# EAGLE design ep2c5(128K+SD) (EAGLE 7.2.0)
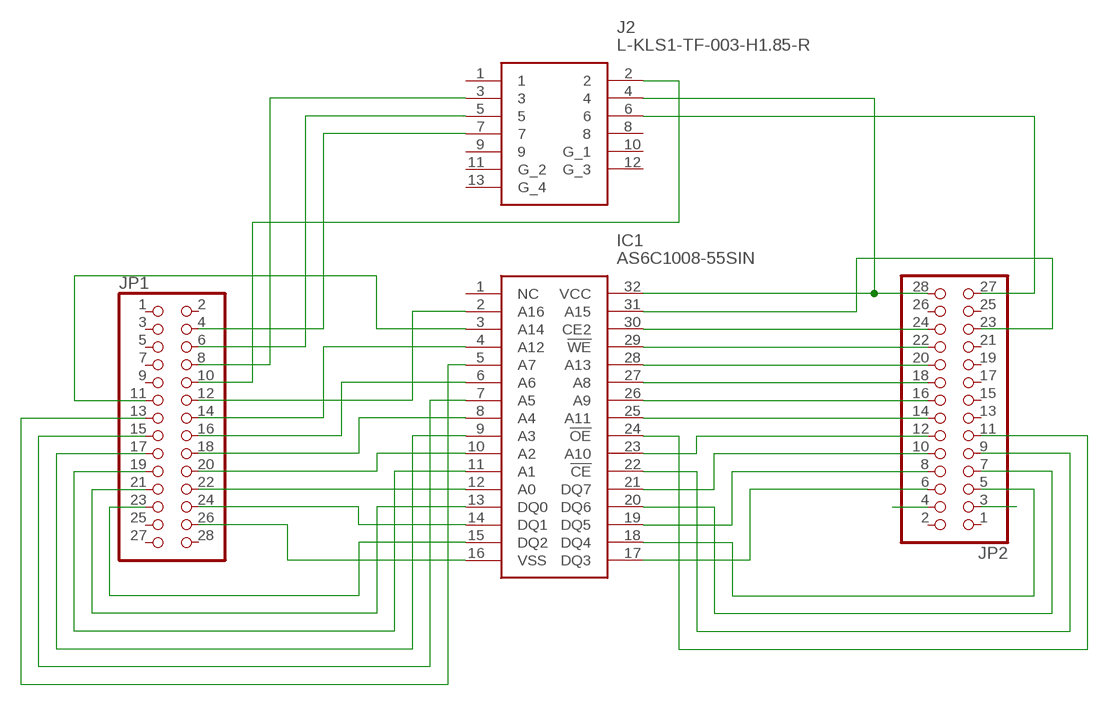
[diagram p0: schematic, sheet 1]

## Parts
IC1  AS6C1008-55SIN  [SOIC127P1407X299-32N]
J2  L-KLS1-TF-003-H1.85-R  [L-KLS1-TF-003-H1.85-R]
JP1  PINHD-2X14  [2X14]
JP2  PINHD-2X14  [2X14]

## Nets
N$1: J2.6 JP2.27
N$2: IC1.15(DQ2) JP1.23
N$3: J2.2 JP1.10
N$4: IC1.14(DQ1) JP1.24
N$5: IC1.12(A0) JP1.22
N$6: IC1.10(A2) JP1.20
N$7: IC1.8(A4) JP1.18
N$8: IC1.6(A6) JP1.16
N$9: J2.3 JP1.8
N$10: J2.5 JP1.6
N$11: J2.7 JP1.4
N$12: IC1.16(VSS) JP1.26
N$15: IC1.31(A15) JP2.23
N$16: IC1.4(A12) JP1.14
N$17: IC1.2(A16) JP1.12
N$18: IC1.13(DQ0) JP1.21
N$19: IC1.11(A1) JP1.19
N$21: IC1.9(A3) JP1.17
N$22: IC1.7(A5) JP1.15
N$23: IC1.5(A7) JP1.13
N$24: IC1.3(A14) JP1.11
N$25: IC1.17(DQ3) JP2.6
N$26: IC1.19(DQ5) JP2.8
N$27: IC1.21(DQ7) JP2.10
N$28: IC1.23(A10) JP2.12
N$29: IC1.18(DQ4) JP2.5
N$30: IC1.20(DQ6) JP2.7
N$31: IC1.22(!CE) JP2.9
N$32: IC1.24(!OE) JP2.11
N$33: IC1.25(A11) JP2.14
N$34: IC1.26(A9) JP2.16
N$37: IC1.27(A8) JP2.18
N$43: IC1.32(VCC) J2.4 JP2.28
N$44: IC1.28(A13) JP2.20
N$45: IC1.29(!WE) JP2.22
N$46: IC1.30(CE2) JP2.24
N$57: JP2.4
N$58: JP2.3
Unconnected: IC1.1(NC) J2.1 J2.8 J2.9 J2.10(G_1) J2.11(G_2) J2.12(G_3) J2.13(G_4) JP1.1 JP1.2 JP1.3 JP1.5 JP1.7 JP1.9 JP1.25 JP1.27 JP1.28 JP2.1 JP2.2 JP2.13 JP2.15 JP2.17 JP2.19 JP2.21 JP2.25 JP2.26

## Library data of the parts
IC1 = AS6C1008-55SIN:AS6C1008-55SIN: Alliance Memory AS6C1008-55SIN SRAM Memory, 1Mbit, 2.7 5.5 V, 55ns 32-Pin SOP Source: Datasheet <https://componentsearchengine.com/Datasheets/2/AS6C1008-55SIN.pdf>; DESCRIPTION: Alliance Memory AS6C1008-55SIN SRAM Memory, 1Mbit, 2.7 5.5 V, 55ns 32-Pin SOP; HEIGHT: mm; MANUFACTURER_NAME: Alliance Memory; MANUFACTURER_PART_NUMBER: AS6C1008-55SIN; MOUSER_PART_NUMBER: 913-AS6C1008-55SIN; MOUSER_PRICE-STOCK: https://www.mouser.com/Search/Refine.aspx?Keyword=913-AS6C1008-55SIN; RS_PART_NUMBER: 0538170; RS_PRICE-STOCK: http://uk.rs-online.com/web/p/products/0538170
J2 = L-KLS1-TF-003-H1.85-R:L-KLS1-TF-003-H1.85-R: Micro SD Card Connector Source: Datasheet <https://img.ozdisan.com/ETicaret_Dosya/476392_7149645.pdf>; DESCRIPTION: Micro SD Card Connector; HEIGHT: mm; MANUFACTURER_NAME: KLS Electronic; MANUFACTURER_PART_NUMBER: L-KLS1-TF-003-H1.85-R
JP1 JP2 = pinhead:PINHD-2X14: PIN HEADER

## Net classes
0 default: width 0.35 mm

## Board
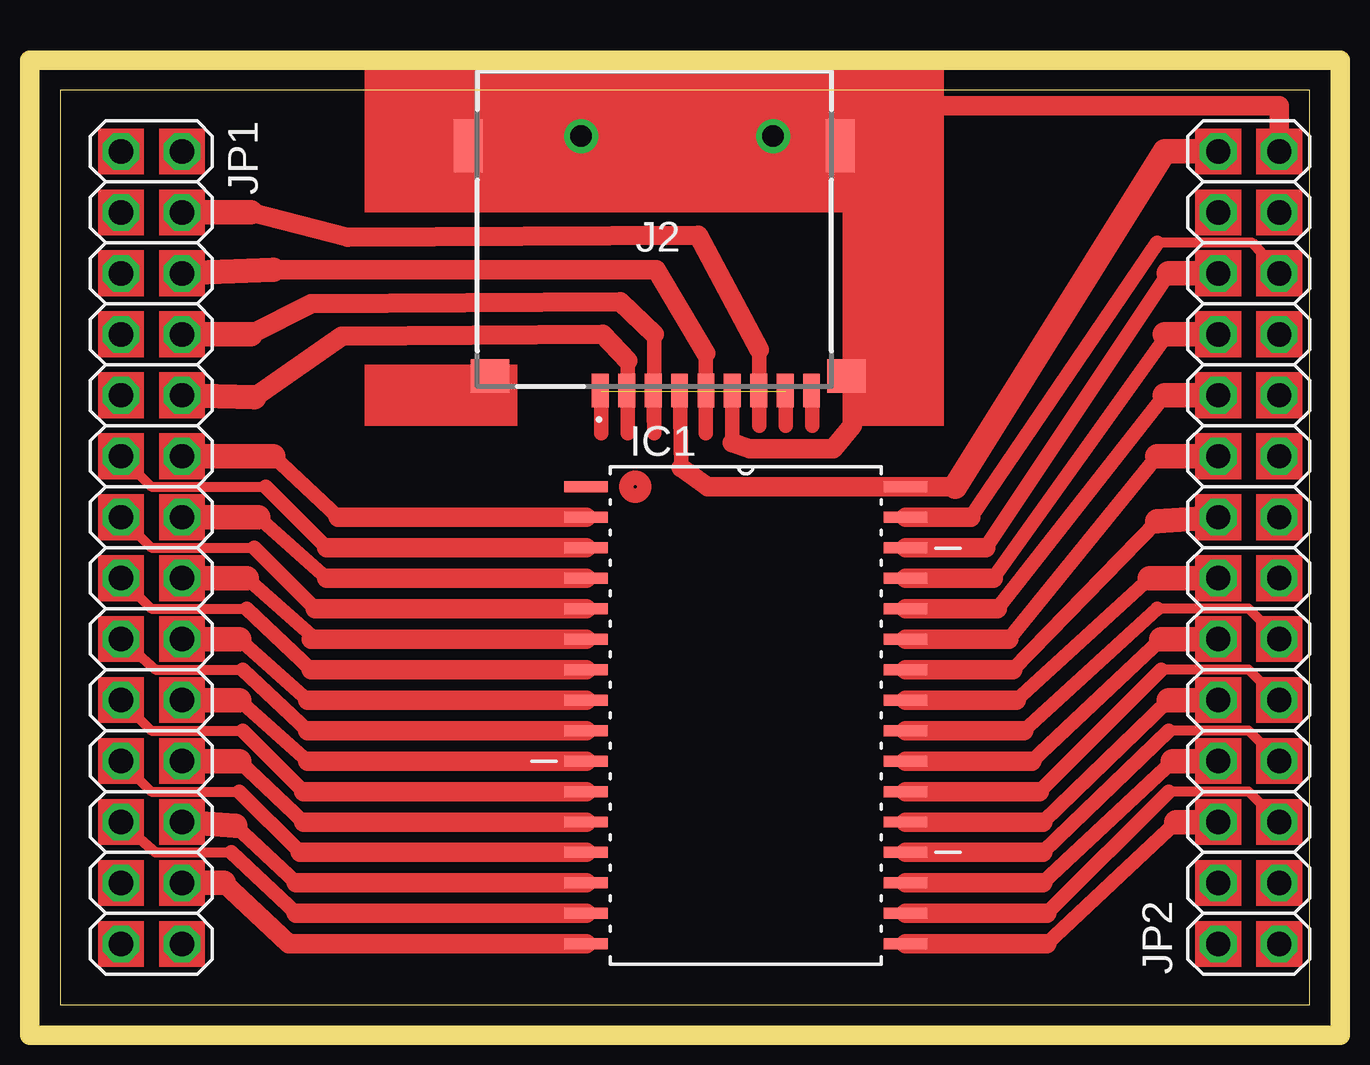
[diagram p1: board, top side]

Size 52.07 x 38.1 mm. Coordinates in mm from the lower left corner, seen from the top.
Outline: 0,0 52.07,0 52.07,38.1 0,38.1 0,0
Copper layers (1*16): Top 0.035mm / dielectric 1.5mm / Bottom 0.035mm
Design rules "default": minimum track width 10mil, minimum drill 24mil, track to track 8mil, track to pad 8mil, pad to pad 8mil, via to via 8mil, smd to smd 8mil, copper to edge 40mil, drill to drill 8mil, minimum pad ring 10mil, minimum via ring 8mil, stop-mask expansion 4mil, vias tented up to drill 0mil, thermal gap 10mil
Milling: 4 lines

### Footprints (pad centres in the part's own frame; a part is rotated, then mirrored left to right if it is on the bottom)
SOIC127P1407X299-32N = smd 1.803 x 0.457: 1 -6.655,9.525; 2 -6.655,8.255; 3 -6.655,6.985; 4 -6.655,5.715; 5 -6.655,4.445; 6 -6.655,3.175; 7 -6.655,1.905; 8 -6.655,0.635; 9 -6.655,-0.635; 10 -6.655,-1.905; 11 -6.655,-3.175; 12 -6.655,-4.445; 13 -6.655,-5.715; 14 -6.655,-6.985; 15 -6.655,-8.255; 16 -6.655,-9.525; 17 6.655,-9.525; 18 6.655,-8.255; 19 6.655,-6.985; 20 6.655,-5.715; 21 6.655,-4.445; 22 6.655,-3.175; 23 6.655,-1.905; 24 6.655,-0.635; 25 6.655,0.635; 26 6.655,1.905; 27 6.655,3.175; 28 6.655,4.445; 29 6.655,5.715; 30 6.655,6.985; 31 6.655,8.255; 32 6.655,9.525
L-KLS1-TF-003-H1.85-R = smd 0.7 x 1.4: 1 2.25,10.6; 2 1.15,10.6; 3 0.05,10.6; 4 -1.05,10.6; 5 -2.15,10.6; 6 -3.25,10.6; 7 -4.35,10.6; 8 -5.45,10.6; 9 -6.55,10.6 | smd 1.6 x 1.4: 10 -8,10; 13 6.85,10 | smd 1.2 x 2.2: 11 -7.75,0.4; 12 7.75,0.4 | drill 0.9 pad 1.4: 14 3.05,0; 15 -4.95,0
2X14 = drill 1.016 octagon: 1 -16.51,-1.27; 2 -16.51,1.27; 3 -13.97,-1.27; 4 -13.97,1.27; 5 -11.43,-1.27; 6 -11.43,1.27; 7 -8.89,-1.27; 8 -8.89,1.27; 9 -6.35,-1.27; 10 -6.35,1.27; 11 -3.81,-1.27; 12 -3.81,1.27; 13 -1.27,-1.27; 14 -1.27,1.27; 15 1.27,-1.27; 16 1.27,1.27; 17 3.81,-1.27; 18 3.81,1.27; 19 6.35,-1.27; 20 6.35,1.27; 21 8.89,-1.27; 22 8.89,1.27; 23 11.43,-1.27; 24 11.43,1.27; 25 13.97,-1.27; 26 13.97,1.27; 27 16.51,-1.27; 28 16.51,1.27

### Placement (x,y rotation side)
IC1  28.57,12.06 0 top
J2  24.77,36.2 180 top
JP1  3.81,19.05 270 top
JP2  49.53,19.05 90 top

### Tracks (layer width: path | path; a pad name or v marks a point on that pad's centre or on a via)
N$1
  Top 0.61: 28.02,23.42 J2.6
  Top 0.813: JP2.27 50.8,37.47 33.02,37.47 33.02,24.13 32.23,23.18 28.73,23.18 28.02,23.42
N$2
  Top 0.406: JP1.23 3.97,6.35 7.14,6.35
  Top 0.61: 7.14,6.35 9.84,3.81
  Top 0.813: 9.84,3.81 IC1.15
N$3
  Top 0.406: J2.2 23.65,23.81
  Top 0.61: 23.65,23.81 23.65,26.83
  Top 0.813: 23.65,26.83 22.62,27.94 11.75,27.86 8.1,25.32
  Top 1.016: 8.1,25.32 JP1.10
N$4
  Top 0.406: JP1.24 5.24,7.62
  Top 0.61: 7.3,7.46 9.84,5.08
  Top 0.813: 9.84,5.08 IC1.14
  Top 1.016: 5.24,7.62 7.3,7.46
N$5
  Top 0.61: 7.46,10.16 10.16,7.62
  Top 0.813: 10.16,7.62 IC1.12
  Top 1.016: JP1.22 7.46,10.16
N$6
  Top 0.61: 7.46,12.7 10.32,10.16
  Top 0.813: 10.32,10.16 IC1.10
  Top 1.016: JP1.20 7.46,12.7
N$7
  Top 0.61: 7.46,15.24 10.32,12.7
  Top 0.813: 10.32,12.7 IC1.8
  Top 1.016: JP1.18 7.46,15.24
N$8
  Top 0.406: 10.48,15.4 10.48,15.24
  Top 0.61: 7.78,17.78 10.48,15.4
  Top 0.813: 10.48,15.24 IC1.6
  Top 1.016: JP1.16 7.78,17.78
N$9
  Top 0.61: J2.3 24.77,23.81 24.77,27.94
  Top 0.813: 24.77,27.94 23.34,29.29 10.48,29.21 7.94,27.94
  Top 1.016: 7.94,27.94 JP1.8
N$10
  Top 0.406: J2.5 26.91,23.81
  Top 0.61: 26.91,23.81 26.91,27.15
  Top 0.813: 26.91,27.15 24.84,30.64 8.89,30.64
  Top 1.016: 8.89,30.64 JP1.6
N$11
  Top 0.406: J2.7 29.13,24.13
  Top 0.61: 29.13,24.13 29.13,27.3
  Top 0.813: 29.13,27.3 26.59,32.07 11.99,31.99 7.94,33.02
  Top 1.016: 7.94,33.02 JP1.4
N$12
  Top 0.813: 6.83,5.08 9.53,2.54 IC1.16
  Top 1.016: JP1.26 6.83,5.08
N$13  (1 unrouted)
  Top 0.61: 30.24,25.56 30.24,24.13 | 22.54,25.56 22.54,23.81
N$14
  Top 0.14: 31.27,25.72 31.35,25.72
  Top 0.61: 31.35,25.72 31.35,24.13
N$15
  Top 0.406: JP2.23 49.69,31.75 45.72,31.75
  Top 0.61: 45.72,31.75 37.94,20.32
  Top 0.813: 37.94,20.32 IC1.31
N$16
  Top 0.61: 8.26,20.32 11.11,17.78
  Top 0.813: 11.11,17.78 IC1.4
  Top 1.016: JP1.14 8.26,20.32
N$17
  Top 0.61: 8.89,22.86 11.59,20.32
  Top 0.813: 11.59,20.32 IC1.2
  Top 1.016: JP1.12 8.89,22.86
N$18
  Top 0.406: JP1.21 3.81,8.89 7.46,8.89
  Top 0.61: 7.46,8.89 10,6.35
  Top 0.813: 10,6.35 IC1.13
N$19
  Top 0.406: JP1.19 3.81,11.43 7.62,11.43
  Top 0.61: 7.62,11.43 10.16,8.89
  Top 0.813: 10.16,8.89 IC1.11
N$21
  Top 0.406: JP1.17 3.97,13.97 7.62,13.97
  Top 0.61: 7.62,13.97 10.32,11.43
  Top 0.813: 10.32,11.43 IC1.9
N$22
  Top 0.406: JP1.15 3.81,16.51 7.78,16.51
  Top 0.61: 7.78,16.51 10.48,13.97
  Top 0.813: 10.48,13.97 IC1.7
N$23
  Top 0.406: JP1.13 3.81,19.05 8.1,19.05
  Top 0.61: 8.1,19.05 10.64,16.51
  Top 0.813: 10.64,16.51 IC1.5
N$24
  Top 0.406: JP1.11 3.81,21.59 8.57,21.59
  Top 0.61: 8.57,21.59 11.11,19.05
  Top 0.813: 11.11,19.05 IC1.3
N$25
  Top 0.61: 46.51,7.62 41.12,2.54
  Top 0.813: 41.12,2.54 IC1.17
  Top 1.016: JP2.6 46.51,7.62
N$26
  Top 0.61: 46.35,10.16 40.96,5.08
  Top 0.813: 40.96,5.08 IC1.19
  Top 1.016: JP2.8 46.35,10.16
N$27
  Top 0.61: 46.2,12.7 40.96,7.62
  Top 0.813: 40.96,7.62 IC1.21
  Top 1.016: JP2.10 46.2,12.7
N$28
  Top 0.61: 45.88,15.24 40.48,10.16
  Top 0.813: 40.48,10.16 IC1.23
  Top 1.016: JP2.12 45.88,15.24
N$29
  Top 0.406: JP2.5 49.53,8.89 46.2,8.89
  Top 0.61: 46.2,8.89 41.12,3.81
  Top 0.813: 41.12,3.81 IC1.18
N$30
  Top 0.406: JP2.7 49.53,11.43 46.2,11.43
  Top 0.61: 46.2,11.43 40.96,6.35
  Top 0.813: 40.96,6.35 IC1.20
N$31
  Top 0.406: JP2.9 49.53,13.97 45.88,13.97
  Top 0.61: 45.88,13.97 40.8,8.89
  Top 0.813: 40.8,8.89 IC1.22
N$32
  Top 0.406: JP2.11 49.53,16.51 45.72,16.51
  Top 0.61: 45.72,16.51 40.16,11.43
  Top 0.813: 40.16,11.43 IC1.24
N$33
  Top 0.61: 45.4,17.78 39.85,12.7
  Top 0.813: 39.85,12.7 IC1.25
  Top 1.016: JP2.14 45.4,17.78
N$34
  Top 0.61: 45.72,20.16 39.69,13.97
  Top 0.813: 39.69,13.97 IC1.26
  Top 1.016: JP2.16 45.72,20.16
N$37
  Top 0.61: 45.72,22.86 39.53,15.24
  Top 0.813: 39.53,15.24 IC1.27
  Top 1.016: JP2.18 45.72,22.86
N$43
  Top 0.61: 25.88,22.38 J2.4
  Top 0.813: 37.31,21.59 IC1.32 26.99,21.59 25.88,22.38
  Top 1.016: JP2.28 46.04,35.56 37.31,21.59
N$44
  Top 0.61: 46.04,25.4 39.05,16.51
  Top 0.813: 39.05,16.51 IC1.28
  Top 1.016: JP2.20 46.04,25.4
N$45
  Top 0.406: 46.04,27.94 46.04,27.78
  Top 0.61: 46.04,27.78 38.89,17.78
  Top 0.813: 38.89,17.78 IC1.29
  Top 1.016: JP2.22 46.04,27.94
N$46
  Top 0.61: 38.58,19.05 46.2,30.48
  Top 0.813: IC1.30 38.58,19.05
  Top 1.016: 46.2,30.48 JP2.24
(copper drawn outside any net)
  shapes: Top area x59, Top circle x1